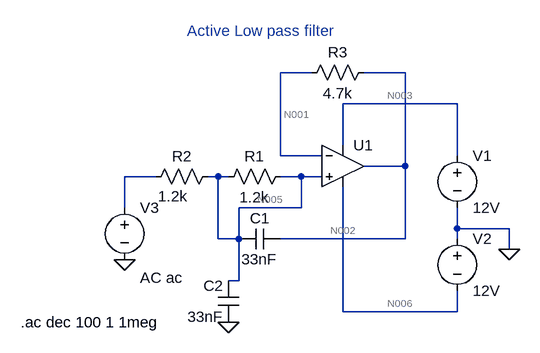
[diagram p0: schematic Draft1.asc]
Draft1.asc, the LTspice schematic file:
Version 4
SHEET 1 880 680
WIRE 32 -16 -16 -16
WIRE 176 -16 112 -16
WIRE 256 32 80 32
WIRE 80 96 80 32
WIRE -16 112 -16 -16
WIRE 48 112 -16 112
WIRE 256 112 256 32
WIRE 176 128 176 -16
WIRE 176 128 112 128
WIRE -208 144 -256 144
WIRE -112 144 -128 144
WIRE -96 144 -112 144
WIRE 16 144 -16 144
WIRE 48 144 16 144
WIRE -256 192 -256 144
WIRE 16 192 16 144
WIRE 16 192 -80 192
WIRE 256 224 256 192
WIRE 336 224 256 224
WIRE -112 240 -112 144
WIRE -80 240 -80 192
WIRE -80 240 -112 240
WIRE 176 240 176 128
WIRE 176 240 -16 240
WIRE 256 240 256 224
WIRE 336 256 336 224
WIRE -80 304 -80 240
WIRE -80 304 -96 304
WIRE 80 352 80 160
WIRE 256 352 256 320
WIRE 256 352 80 352
FLAG -256 272 0
FLAG -96 368 0
FLAG 336 256 0
SYMBOL voltage 256 96 R0
SYMATTR InstName V1
SYMATTR Value 12V
SYMBOL voltage 256 224 R0
SYMATTR InstName V2
SYMATTR Value 12V
SYMBOL voltage -256 176 R0
WINDOW 123 24 124 Left 2
WINDOW 39 0 0 Left 0
SYMATTR Value2 AC ac
SYMATTR InstName V3
SYMATTR Value ""
SYMBOL res 0 128 R90
WINDOW 0 0 56 VBottom 2
WINDOW 3 32 56 VTop 2
SYMATTR InstName R1
SYMATTR Value 1.2k
SYMBOL res -112 128 R90
WINDOW 0 0 56 VBottom 2
WINDOW 3 46 47 VRight 2
SYMATTR InstName R2
SYMATTR Value 1.2k
SYMBOL cap -16 224 R90
WINDOW 0 0 32 VBottom 2
WINDOW 3 32 32 VTop 2
SYMATTR InstName C1
SYMATTR Value 33nF
SYMBOL cap -80 368 R180
WINDOW 0 24 56 Left 2
WINDOW 3 24 8 Left 2
SYMATTR InstName C2
SYMATTR Value 33nF
SYMBOL OpAmps\\UniversalOpAmp 80 128 R0
SYMATTR InstName U1
SYMBOL res 128 -32 R90
WINDOW 0 0 56 VBottom 2
WINDOW 3 32 56 VTop 2
SYMATTR InstName R3
SYMATTR Value 4.7k
TEXT -160 -80 Left 2 ;Active Low pass filter
TEXT -416 368 Left 2 !.ac dec 100 1 1meg

The netlist it stands for:
* Draft1.asc
V1 N003 0 12V
V2 0 N006 12V
V3 N004 0 AC ac
R1 N005 N005 1.2k
R2 N005 N004 1.2k
C1 N002 N005 33nF
C2 0 N005 33nF
XU1 N005 N001 N003 N006 N002 level1 Avol=1Meg GBW=10Meg Vos=0 En=0 Enk=0 In=0 Ink=0 Rin=500Meg  ; pins In+ In- V+ V- OUT
R3 N002 N001 4.7k
* Active Low pass filter
.ac dec 100 1 1meg
.lib UniversalOpAmp1.lib
.backanno
.end

* Results of the author's LTspice run, read from the files saved beside the schematic
* Operating Point, zero values left out:
*   V(n003) = 12 V
*   V(n006) = -12 V
*   I(V1) = -24 nA
*   I(V2) = -24 nA
*   Ix(u1:3) = 24 nA
*   Ix(u1:4) = -24 nA
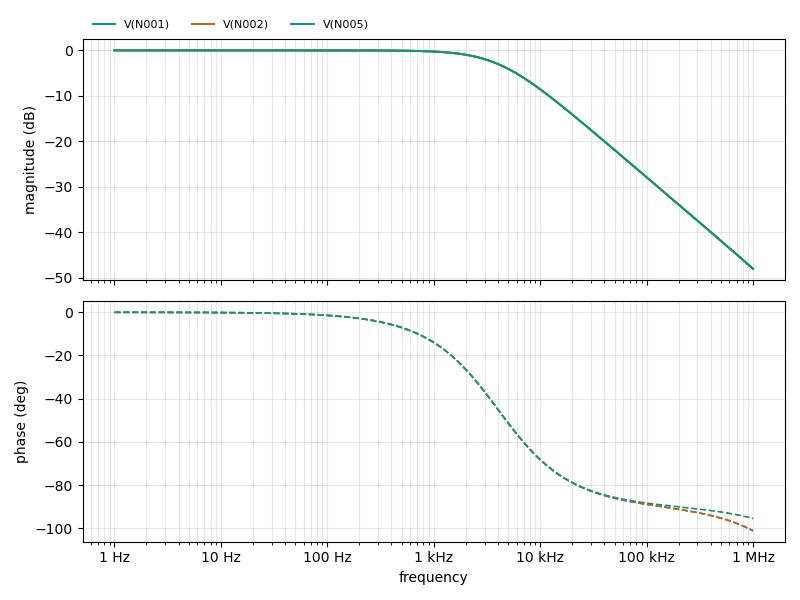
[diagram p1: AC Analysis of Draft1.asc, plotted from the saved traces]
* AC Analysis, 1 run:
*   V(N001): -0.00 dB at 1 Hz, -48.08 dB at 1 MHz, peak -0.00 dB at 1 Hz, 3 dB below the peak at 4.02 kHz
*   V(N002): 0.00 dB at 1 Hz, -48.08 dB at 1 MHz, peak 0.00 dB at 1 Hz, 3 dB below the peak at 4.02 kHz
*   V(N005): -0.00 dB at 1 Hz, -48.04 dB at 1 MHz, peak -0.00 dB at 1 Hz, 3 dB below the peak at 4.02 kHz